# Altium schematic sheet PD.SchDoc
size A2; SheetNumber: 18; SheetTotal: 18
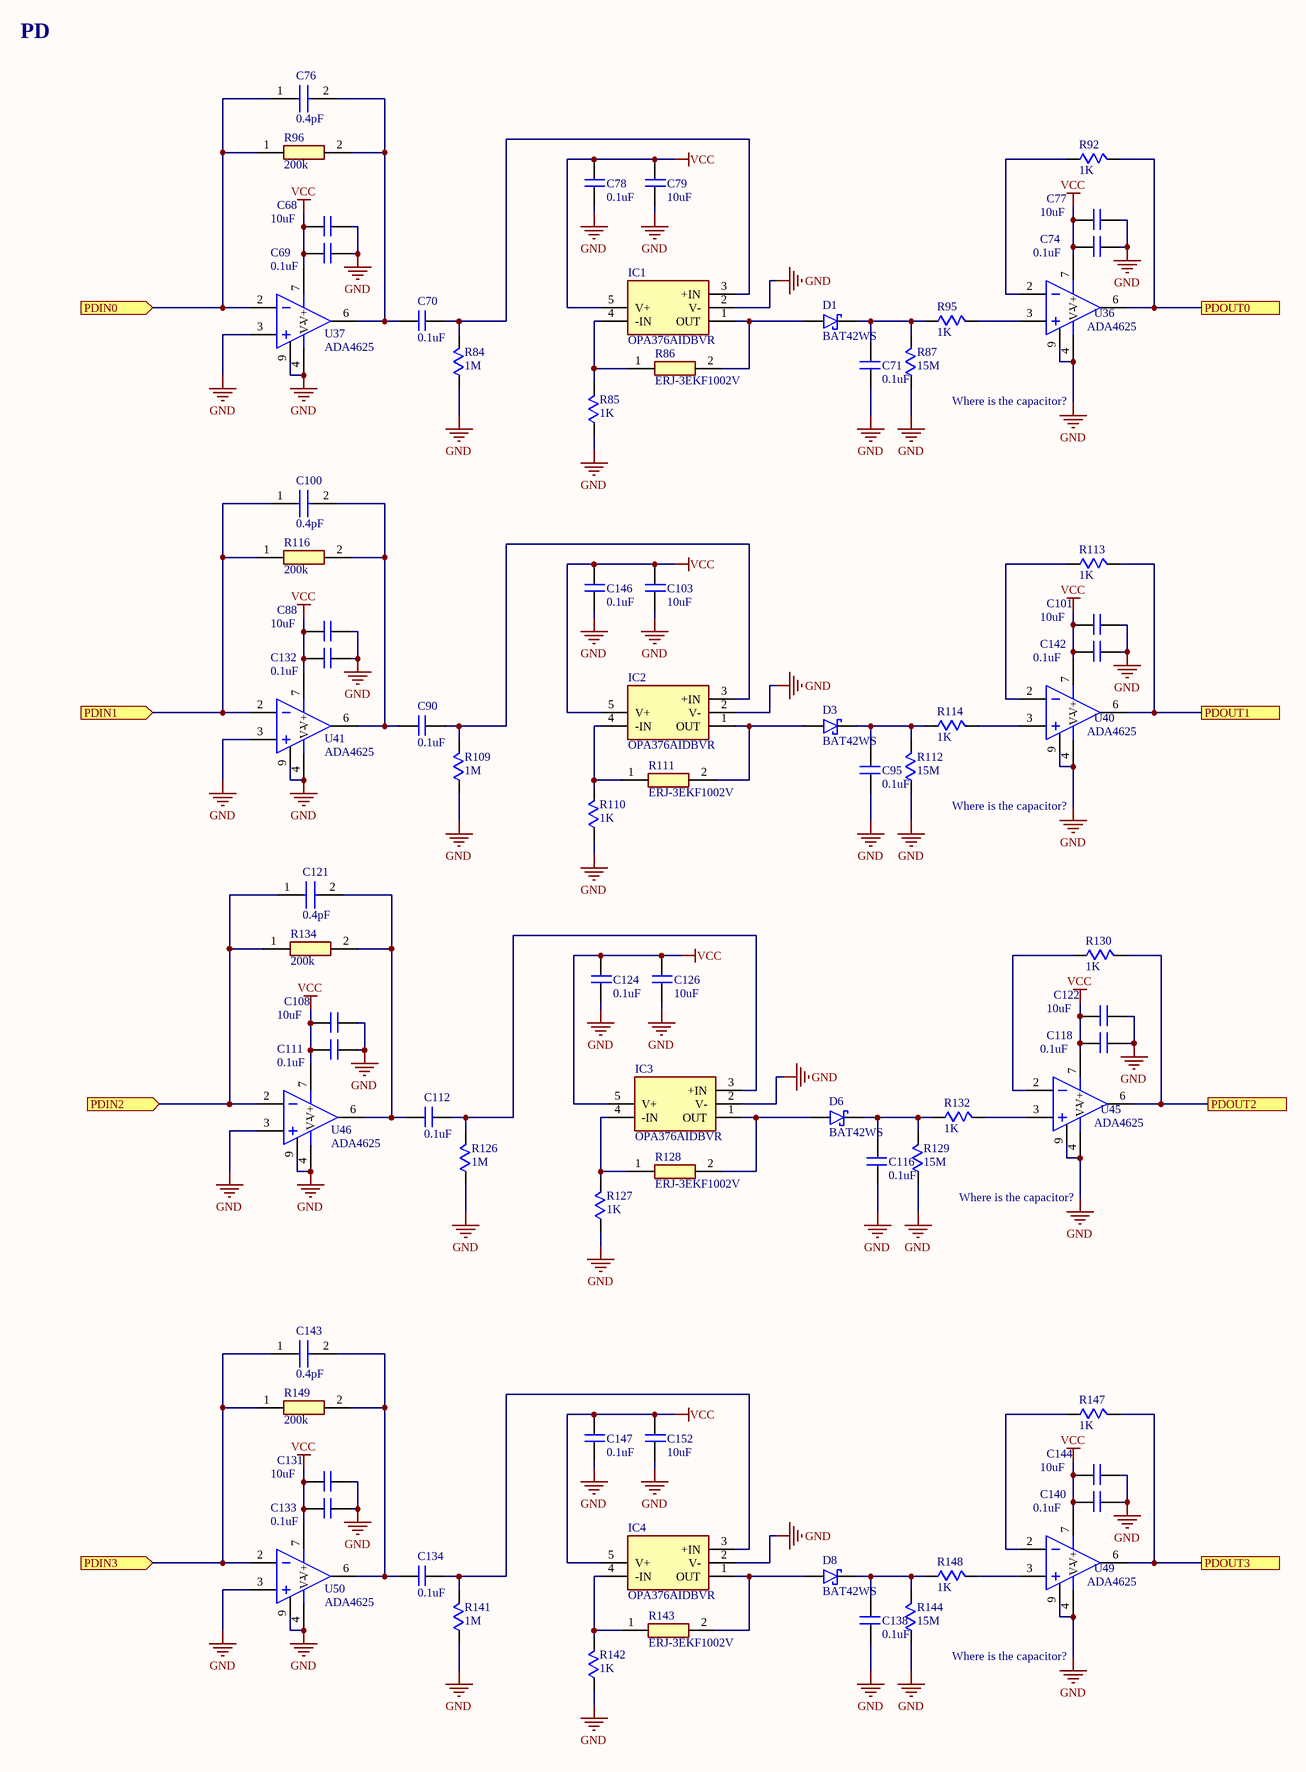
[diagram p0: PD.SchDoc]

## Parts
C68  10uF  [CAP0805]
C69  0.1uF  [CAP0603]
C70  0.1uF  [CAP0603]
C71  0.1uF  [CAP0603]
C74  0.1uF  [CAP0603]
C76  0.4pF  [CAPC1608X87N]
C77  10uF  [CAP0805]
C78  0.1uF  [CAP0603]
C79  10uF  [CAP0805]
C88  10uF  [CAP0805]
C90  0.1uF  [CAP0603]
C95  0.1uF  [CAP0603]
C100  0.4pF  [CAPC1608X87N]
C101  10uF  [CAP0805]
C103  10uF  [CAP0805]
C108  10uF  [CAP0805]
C111  0.1uF  [CAP0603]
C112  0.1uF  [CAP0603]
C116  0.1uF  [CAP0603]
C118  0.1uF  [CAP0603]
C121  0.4pF  [CAPC1608X87N]
C122  10uF  [CAP0805]
C124  0.1uF  [CAP0603]
C126  10uF  [CAP0805]
C131  10uF  [CAP0805]
C132  0.1uF  [CAP0603]
C133  0.1uF  [CAP0603]
C134  0.1uF  [CAP0603]
C138  0.1uF  [CAP0603]
C140  0.1uF  [CAP0603]
C142  0.1uF  [CAP0603]
C143  0.4pF  [CAPC1608X87N]
C144  10uF  [CAP0805]
C146  0.1uF  [CAP0603]
C147  0.1uF  [CAP0603]
C152  10uF  [CAP0805]
D1  BAT42WS  [SOD-123]
D3  BAT42WS  [SOD-123]
D6  BAT42WS  [SOD-123]
D8  BAT42WS  [SOD-123]
IC1  OPA376AIDBVR  [SOT95P280X145-5N]
IC2  OPA376AIDBVR  [SOT95P280X145-5N]
IC3  OPA376AIDBVR  [SOT95P280X145-5N]
IC4  OPA376AIDBVR  [SOT95P280X145-5N]
R84  1M  [RES0603]
R85  1K  [RES0805]
R86  ERJ-3EKF1002V  [RESC1608X55N]
R87  15M  [RES0603]
R92  1K  [RES0805]
R95  1K  [RES0805]
R96  200k  [ERA3AEB101V]
R109  1M  [RES0603]
R110  1K  [RES0805]
R111  ERJ-3EKF1002V  [RESC1608X55N]
R112  15M  [RES0603]
R113  1K  [RES0805]
R114  1K  [RES0805]
R116  200k  [ERA3AEB101V]
R126  1M  [RES0603]
R127  1K  [RES0805]
R128  ERJ-3EKF1002V  [RESC1608X55N]
R129  15M  [RES0603]
R130  1K  [RES0805]
R132  1K  [RES0805]
R134  200k  [ERA3AEB101V]
R141  1M  [RES0603]
R142  1K  [RES0805]
R143  ERJ-3EKF1002V  [RESC1608X55N]
R144  15M  [RES0603]
R147  1K  [RES0805]
R148  1K  [RES0805]
R149  200k  [ERA3AEB101V]
U36  ADA4625  [SOIC8]
U37  ADA4625  [SOIC8]
U40  ADA4625  [SOIC8]
U41  ADA4625  [SOIC8]
U45  ADA4625  [SOIC8]
U46  ADA4625  [SOIC8]
U49  ADA4625  [SOIC8]
U50  ADA4625  [SOIC8]

## Ports
PDIN0 (in, see ADC-DAC[5D]), PDIN1 (in, see ADC-DAC[5D]), PDIN2 (in, see ADC-DAC[5D]), PDIN3 (in, see ADC-DAC[5D]), PDOUT0 (see ADC-DAC[5B]), PDOUT1 (see ADC-DAC[3B]), PDOUT2 (see ADC-DAC[3A]), PDOUT3 (see ADC-DAC[7A])

## Nets
GND: C68.2 C69.2 C71.1 C74.2 C77.2 C78.2 C79.2 C88.2 C95.1 C101.2 C103.2 C108.2 C111.2 C116.1 C118.2 C122.2 C124.2 C126.2 C131.2 C132.2 C133.2 C138.1 C140.2 C142.2 C144.2 C146.2 C147.2 C152.2 IC1.2(V-) IC2.2(V-) IC3.2(V-) IC4.2(V-) R84.1 R85.1 R87.1 R109.1 R110.1 R112.1 R126.1 R127.1 R129.1 R141.1 R142.1 R144.1 U36.4(V-) U36.9 U37.3(IN+) U37.4(V-) U37.9 U40.4(V-) U40.9 U41.3(IN+) U41.4(V-) U41.9 U45.4(V-) U45.9 U46.3(IN+) U46.4(V-) U46.9 U49.4(V-) U49.9 U50.3(IN+) U50.4(V-) U50.9
VCC: C68.1 C69.1 C74.1 C77.1 C78.1 C79.1 C88.1 C101.1 C103.1 C108.1 C111.1 C118.1 C122.1 C124.1 C126.1 C131.1 C132.1 C133.1 C140.1 C142.1 C144.1 C146.1 C147.1 C152.1 IC1.5(V+) IC2.5(V+) IC3.5(V+) IC4.5(V+) U36.7(V+) U37.7(V+) U40.7(V+) U41.7(V+) U45.7(V+) U46.7(V+) U49.7(V+) U50.7(V+)
PDIN0: C76.1 R96.1 U37.2(IN-) ; port PDIN0
PDIN1: C100.1 R116.1 U41.2(IN-) ; port PDIN1
PDIN2: C121.1 R134.1 U46.2(IN-) ; port PDIN2
PDIN3: C143.1 R149.1 U50.2(IN-) ; port PDIN3
PDOUT0: R92.2 U36.6(OUT) ; port PDOUT0
PDOUT1: R113.2 U40.6(OUT) ; port PDOUT1
PDOUT2: R130.2 U45.6(OUT) ; port PDOUT2
PDOUT3: R147.2 U49.6(OUT) ; port PDOUT3
NetC70_1: C70.1 C76.2 R96.2 U37.6(OUT)
NetC70_2: C70.2 IC1.3(+IN) R84.2
NetC71_2: C71.2 D1.1 R87.2 R95.1
NetC90_1: C90.1 C100.2 R116.2 U41.6(OUT)
NetC90_2: C90.2 IC2.3(+IN) R109.2
NetC95_2: C95.2 D3.1 R112.2 R114.1
NetC112_1: C112.1 C121.2 R134.2 U46.6(OUT)
NetC112_2: C112.2 IC3.3(+IN) R126.2
NetC116_2: C116.2 D6.1 R129.2 R132.1
NetC134_1: C134.1 C143.2 R149.2 U50.6(OUT)
NetC134_2: C134.2 IC4.3(+IN) R141.2
NetC138_2: C138.2 D8.1 R144.2 R148.1
NetD1_2: D1.2 IC1.1(OUT) R86.2
NetD3_2: D3.2 IC2.1(OUT) R111.2
NetD6_2: D6.2 IC3.1(OUT) R128.2
NetD8_2: D8.2 IC4.1(OUT) R143.2
NetIC1_4: IC1.4(-IN) R85.2 R86.1
NetIC2_4: IC2.4(-IN) R110.2 R111.1
NetIC3_4: IC3.4(-IN) R127.2 R128.1
NetIC4_4: IC4.4(-IN) R142.2 R143.1
NetR92_1: R92.1 U36.2(IN-)
NetR95_2: R95.2 U36.3(IN+)
NetR113_1: R113.1 U40.2(IN-)
NetR114_2: R114.2 U40.3(IN+)
NetR130_1: R130.1 U45.2(IN-)
NetR132_2: R132.2 U45.3(IN+)
NetR147_1: R147.1 U49.2(IN-)
NetR148_2: R148.2 U49.3(IN+)

## Notes on the sheet
- PD
- Where is the capacitor?

## Library data of the parts
C68 C77 C79 C88 C101 C103 C108 C122 C126 C131 C144 C152 = Capacitor 10uF GRM21BZ71E106KE15L: 25V 10uF X7R ±10% 0805 Multilayer Ceramic Capacitors MLCC - SMD/SMT ROHS; Manufacturer: Murata; Material: 4241ConductorMaterial; Supplier: Mouser; Supplier Part Number: 81-GRM21BZ71E106KE5L; Manufacturer Part Number: GRM21BZ71E106KE15L; RoHS: Yes; Category: Ceramic Capacitors; Stock: 227168; Case/Package: 339Case; Min Operating Temperature: -55°C; Max Operating Temperature: 125°C; Value: 10uF; Tolerance: 10%; Voltage Rating: 25V; Length: 2mm; Width: 1.25mm; Height: 1.45mm; Thickness: 1.25mm; RoHS Compliant: Yes; ComponentLink1URL: https://datasheet.octopart.com/GRM21BZ71E106KE15L-Murata-datasheet-165579666.pdf?src-supplier=TME; ComponentLink1Description: https://datasheet.octopart.com/GRM21BZ71E106KE15L-Murata-datasheet-165579666.pdf?src-supplier=TME; Supplier 1: Mouser; Supplier Part Number 1: 81-GRM21BZ71E106KE5L
C69-C71 C74 C78 C90 C95 C111 C112 C116 C118 C124 C132-C134 C138 C140 C142 C146 C147 = Capacitor 0.1uF: 50V 100nF X5R 卤10% 0603 Multilayer Ceramic Capacitors MLCC - SMD/SMT ROHS; Manufacturer: TDK; Manufacturer Part Number: C1608X5R1H104K080AA; Material: 4241ConductorMaterial; Tolerance: 10%; Supplier: Mouser; Supplier Part Number: 810-C1608X5R1H104K; RoHS: Yes; Category: Ceramic Capacitors; Stock: 239770; Pricing: 1=0.1, 10=0.051, 50=0.051, 100=0.031, 1000=0.021, 10000=0.012 (USD); Mounting Technology: Surface Mount; Case/Package: 0603; Pins: 2NUMBER; Case Code (Metric): 1608; Case Code (Imperial): 0603; Weight: 7.1E-05oz; Dielectric Material: 4241ConductorMaterial; Min Operating Temperature: -55°C; Max Operating Temperature: 85°C; Value: 100nF; Voltage Rating: 50V; Package Quantity: 1; Packaging: Tape and Reel; Voltage Rating (DC): 50V; Dielectric: X5R; Termination: SMD/SMT; Series: C; Construction: Flat; Length: 1.6mm; Width: 0.031inch; Height: 0.8mm; Thickness: 0.035inch; Depth: 0.8mm; Radiation Hardening: No; Reach SVHC Compliant: No; RoHS Compliant: Yes; Lead Free: 5697LeadFree; ComponentLink1URL: https://datasheet.ciiva.com/24219/mlcc-commercial-general-en-24219452.pdf?src-supplier=Mouser; ComponentLink1Description: https://datasheet.ciiva.com/24219/mlcc-commercial-general-en-24219452.pdf?src-supplier=Mouser; ComponentLink2URL: https://datasheet.ciiva.com/7975/1796654-7975081.pdf?src-supplier=Element14; ComponentLink2Description: https://datasheet.ciiva.com/7975/1796654-7975081.pdf?src-supplier=Element14; ComponentLink3URL: https://datasheet.ciiva.com/22694/1796654-22694121.pdf?src-supplier=Element14; ComponentLink3Description: https://datasheet.ciiva.com/22694/1796654-22694121.pdf?src-supplier=Element14; ComponentLink4URL: https://datasheet.ciiva.com/28577/1735394-28577228.pdf?src-supplier=Element14; ComponentLink4Description: https://datasheet.ciiva.com/28577/1735394-28577228.pdf?src-supplier=Element14; ComponentLink5URL: https://datasheet.ciiva.com/6275/tdkmlcccaprange-6275223.pdf?src-supplier=Digikey; ComponentLink5Description: https://datasheet.ciiva.com/6275/tdkmlcccaprange-6275223.pdf?src-supplier=Digikey; Supplier 1: Mouser; Supplier Part Number 1: 810-C1608X5R1H104K
C76 C100 C121 C143 = CBR06C408B5GAC: Capacitor; Manufacturer_Name: Yageo Group; Datasheet Link: https://www.yageogroup.com/content/datasheet/asset/file/KEM_C1030_CBR_SMD; Height: 0.87mm; Manufacturer_Part_Number: CBR06C408B5GAC; Value: 0.4pF
D1 D3 D6 D8 = BAT42WS-E3-18: Rectifier Diode, Schottky, 1 Phase, 1 Element, 0.2A, 30V V(RRM), Silicon; Manufacturer: Vishay; Max Power Dissipation: 150mW; Forward Voltage: 650mV; Forward Current: 200mA; Max Forward Surge Current (Ifsm): 4A; Max Reverse Current: 100uA; Reverse Recovery Time: 5ns; Supplier: Mouser; Supplier Part Number: 78-BAT42WS-E3-18; Manufacturer Part Number: BAT42WS-E3-18; RoHS: Yes; Category: Rectifier Diodes; Stock: 24379; Pricing: 1=0.3, 10=0.193, 50=0.193, 100=0.119, 1000=0.073, 10000=0.045 (USD); Mounting Technology: Surface Mount; Case/Package: SOD-323-2; Weight: 0.000152oz; Contact Plating: Tin; Min Operating Temperature: -55°C; Max Operating Temperature: 125°C; Packaging: Tape and Reel; Package Quantity: 10000; Max Repetitive Reverse Voltage (Vrrm): 30V; Average Rectified Current: 200mA; Peak Non-Repetitive Surge Current: 4A; Max Reverse Voltage (DC): 30V; Series: Automotive, AEC-Q101; RoHS Compliant: Yes; ComponentLink1URL: http://www.mouser.com/ds/2/427/bat42wsv-57684.pdf?src-supplier=Mouser; ComponentLink1Description: http://www.mouser.com/ds/2/427/bat42wsv-57684.pdf?src-supplier=Mouser; ComponentLink2URL: http://www.vishay.com/docs/81813/bat42wsv.pdf?src-supplier=Avnet; ComponentLink2Description: http://www.vishay.com/docs/81813/bat42wsv.pdf?src-supplier=Avnet; ComponentLink3URL: http://www.vishay.com/docs/81813/bat42wsv.pdf?src-supplier=Digikey; ComponentLink3Description: http://www.vishay.com/docs/81813/bat42wsv.pdf?src-supplier=Digikey; ComponentLink4URL: http://www.vishay.com/docs/81813/bat42ws.pdf?src-supplier=Digikey; ComponentLink4Description: http://www.vishay.com/docs/81813/bat42ws.pdf?src-supplier=Digikey; Supplier 1: Mouser; Supplier Part Number 1: 78-BAT42WS-E3-18
IC1-IC4 = OPA376AIDBVR: Integrated Circuit; Manufacturer_Name: Texas Instruments; Datasheet Link: http://www.ti.com/lit/gpn/OPA376; Height: 1.45mm; Manufacturer_Part_Number: OPA376AIDBVR; Mouser Part Number: 595-OPA376AIDBVR; Mouser Price/Stock: https://www.mouser.co.uk/ProductDetail/Texas-Instruments/OPA376AIDBVR?qs=xL7PkI2RoJ57GVtJklM7uw%3D%3D; Arrow Part Number: OPA376AIDBVR; Arrow Price/Stock: https://www.arrow.com/en/products/opa376aidbvr/texas-instruments?utm_currency=USD&region=nac
R84 R109 R126 R141 = Resistor 1M
R85 R92 R95 R110 R113 R114 R127 R130 R132 R142 R147 R148 = Resistor 1K
R86 R111 R128 R143 = ERJ-3EKF1002V: Resistor; Manufacturer_Name: Panasonic; Datasheet Link: http://industrial.panasonic.com/cdbs/www-data/pdf/RDA0000/AOA0000C86.pdf; Height: 0.55mm; Manufacturer_Part_Number: ERJ-3EKF1002V; Mouser Part Number: 667-ERJ-3EKF1002V; Mouser Price/Stock: https://www.mouser.co.uk/ProductDetail/Panasonic/ERJ-3EKF1002V?qs=H7k1u0Mp9JSrGPQ5%2F5COuw%3D%3D; Arrow Part Number: ERJ-3EKF1002V; Arrow Price/Stock: https://www.arrow.com/en/products/erj-3ekf1002v/panasonic?utm_currency=USD&region=nac
R87 R112 R129 R144 = Resistor 15M
R96 R116 R134 R149 = ERA-3AED204V: Resistor; Manufacturer_Name: Panasonic; Datasheet Link: https://industrial.panasonic.com/cdbs/www-data/pdf/RDM0000/AOA0000C307.pdf; Height: 0.55mm; Manufacturer_Part_Number: ERA-3AED204V; Mouser Part Number: 667-ERA-3AED204V; Mouser Price/Stock: https://www.mouser.co.uk/ProductDetail/Panasonic/ERA-3AED204V?qs=yocZuyCaXdP38wCRmeWMzA%3D%3D; Arrow Part Number: ERA-3AED204V; Arrow Price/Stock: https://www.arrow.com/en/products/era-3aed204v/panasonic?region=nac
U36 U37 U40 U41 U45 U46 U49 U50 = ADA4625-1ARDZ: Op Amp Single Low Noise Amplifier R-R O/P ±18V/36V 8-Pin SOIC N EP Tube; Manufacturer: Analog Devices; Supplier: Mouser; Supplier Part Number: 584-ADA4625-1ARDZ; Manufacturer Part Number: ADA4625-1ARDZ; RoHS: Yes; Category: Amplifiers - Op Amps, Buffer, Instrumentation; Stock: 890; Pricing: 1=12.22, 10=8.4, 50=6.3, 100=5.98, 1000=5.98, 10000=5.98 (USD); ComponentLink1URL: https://datasheet.octopart.com/ADA4625-1ARDZ-Analog-Devices-datasheet-155467704.pdf?src-supplier=Element14; ComponentLink1Description: https://datasheet.octopart.com/ADA4625-1ARDZ-Analog-Devices-datasheet-155467704.pdf?src-supplier=Element14; ComponentLink2URL: https://www.analog.com/media/en/technical-documentation/data-sheets/ADA4625-1.pdf?src-supplier=Digikey; ComponentLink2Description: https://www.analog.com/media/en/technical-documentation/data-sheets/ADA4625-1.pdf?src-supplier=Digikey; ComponentLink3URL: https://datasheet.octopart.com/ADA4625-1ARDZ-Analog-Devices-datasheet-142523027.pdf?src-supplier=Arrow.cn; ComponentLink3Description: https://datasheet.octopart.com/ADA4625-1ARDZ-Analog-Devices-datasheet-142523027.pdf?src-supplier=Arrow.cn; Supplier 1: Mouser; Supplier Part Number 1: 584-ADA4625-1ARDZ